# Altium project PCB_Project1.PrjPCB (part 2 of 2)

## Sheet U1 Schematic.SchDoc
size A4
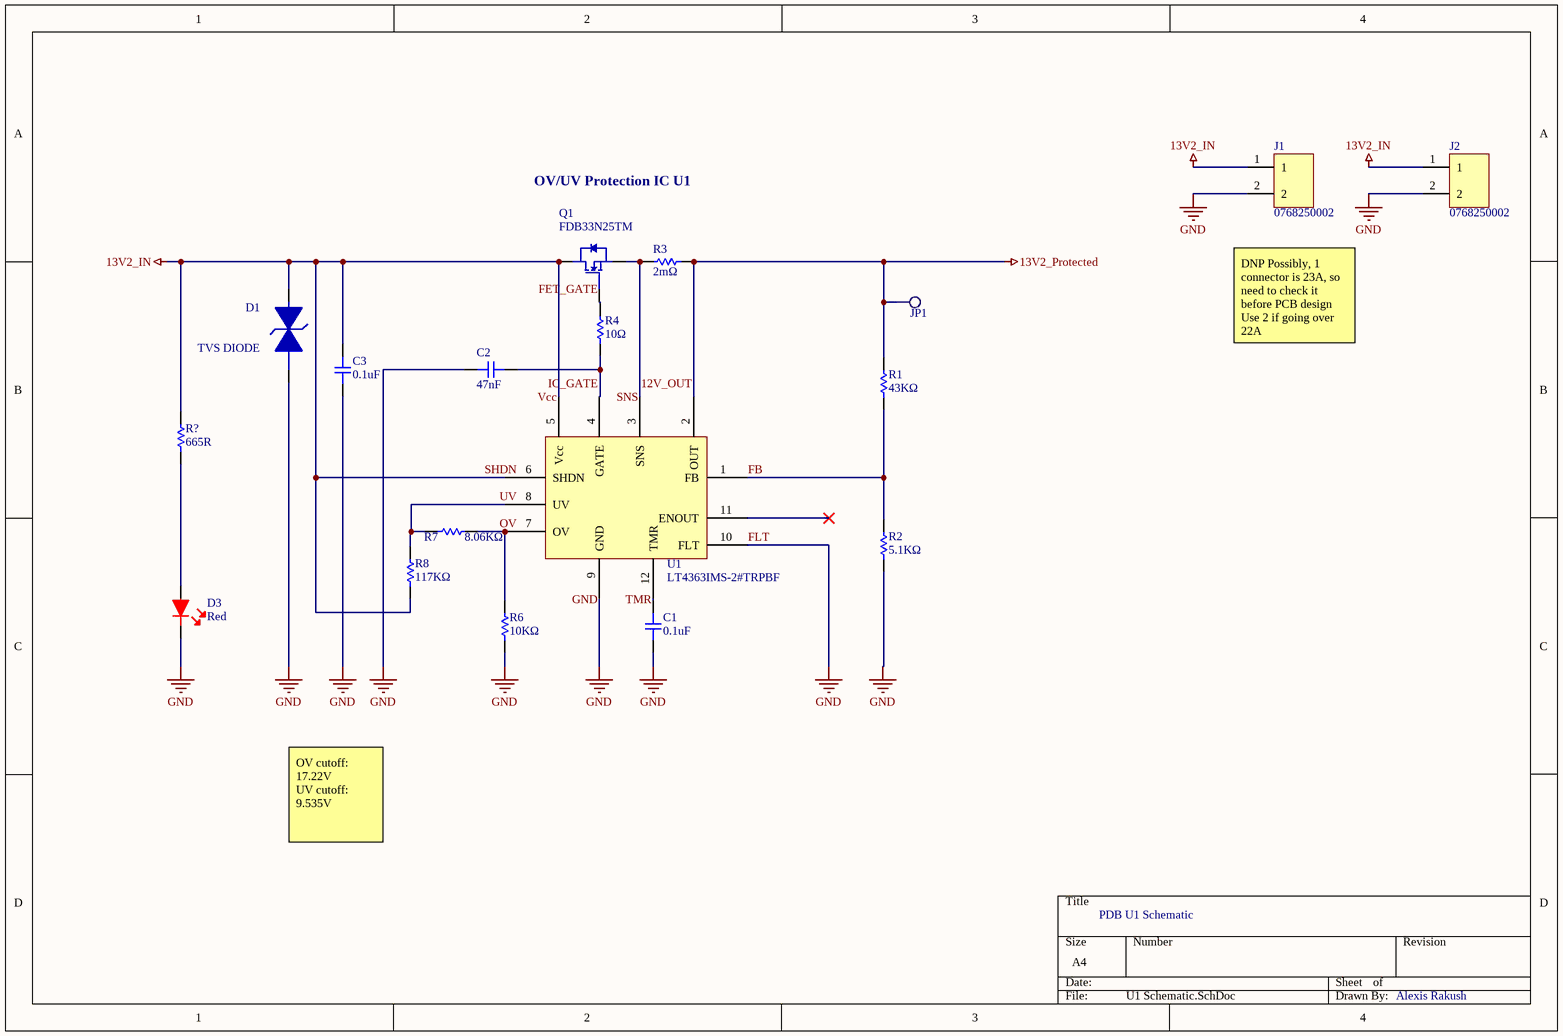
[diagram p1: U1 Schematic.SchDoc]

### Parts
(Parts that share a designator on the sheet are numbered #1, #2 ... from top to bottom, then left to right.)
C1  0.1uF  [CAP-0603]
C2  47nF  [CAP-0603]
C3#2  0.1uF  [CAP-0805]
D1  TVS DIODE  [DIODE_TVS]
D3#2  Red  [LED-0603]
J1  0768250002  [2X1PIN]
J2  0768250002  [2X1PIN]
JP1  Testpoint2  [TP2]  (value not drawn)
Q1  FDB33N25TM
R1  43KΩ
R2  5.1KΩ
R3  2mΩ  [RES-0805]
R4  10Ω  [RES-0805]
R6  10KΩ  [RES-0805]
R7  8.06KΩ  [RES-0603]
R8  117KΩ
R?#3  665R  [RES-0603]
U1  LT4363IMS-2#TRPBF

### Nets
12V_OUT: JP1.1 R1.2 R3.1 U1.2(OUT)  [also labelled 13V2_Protected]
FLT: C1.1 C2.1 C3#2.1 D1.2 D3#2.2 J1.2 J2.2 R2.1 R6.1 U1.9(GND) U1.10(FLT)  [also labelled GND]
Vcc: C3#2.2 D1.1 J1.1 J2.1 Q1.4 R8.1 R?#3.2 U1.5(Vcc) U1.6(SHDN)  [also labelled 13V2_IN]
FB: R1.1 R2.2 U1.1(FB)
SNS: Q1.3 R3.2 U1.3(SNS)
TMR: C1.2 U1.12(TMR)
NetC2_2: C2.2 R4.1 U1.4(GATE)
NetD3#2_1: D3#2.1 R?#3.1
NetQ1_1: Q1.1 R4.2
NetR6_2: R6.2 R7.2 U1.7(OV)
NetR7_1: R7.1 R8.2 U1.8(UV)

Not connected (* = marked no-connect by the designer): U1 11(ENOUT)*

### Notes on the sheet
- OV/UV Protection IC U1
- DNP Possibly, 1 connector is 23A, so need to check it before PCB design
  Use 2 if going over 22A
- OV cutoff: 17.22V
  UV cutoff: 9.535V
- PDB U1 Schematic
- Alexis Rakush
- Labels drawn without touching a wire or pin: FET_GATE, IC_GATE, OV, SHDN, UV

### Library data of the parts
C1 = 0603-0.1uF-16V: CAP CER 0.1UF 16V X7R 0603; Manufacturer: KEMET; Manufacturer Part Number: C0603C104M4RACTU; Dielectric Material: Ceramic; Capacitance: 100nF; Tolerance: 20%; Supplier 1: Digi-Key; Stock 1: 254524; Pricing 1: 1=0.1, 10=0.036, 100=0.0161, 500=0.01152, 1000=0.00904 (USD); Mount: Surface Mount,PCB; Case/Package: 0603; Number of Pins: 2; Case Code (Metric): 1608; Case Code (Imperial): 0603; Min Operating Temperature: -55°C; Max Operating Temperature: 125°C; Package Quantity: 1; Voltage Rating: 16V; Packaging: Tape and Reel; Voltage Rating (DC): 16V; Dielectric: X7R; Termination: SMD/SMT; Length: 1.6mm; Height: 0.8mm; Width: 0.031inch; Thickness: 0.034inch; Lead Pitch: 0.7mm; Depth: 0.8mm; Radiation Hardening: No; REACH SVHC: No SVHC; ComponentLink1URL: https://www.verical.com/server-webapp/html/getDatasheet?partID=66190&src-supplier=Verical; ComponentLink1Description: https://www.verical.com/server-webapp/html/getDatasheet?partID=66190&src-supplier=Verical; ComponentLink2URL: http://www.farnell.com/datasheets/2746055.pdf?src-supplier=Element14; ComponentLink2Description: http://www.farnell.com/datasheets/2746055.pdf?src-supplier=Element14; ComponentLink3URL: http://www.farnell.com/datasheets/2123765.pdf?src-supplier=Element14; ComponentLink3Description: http://www.farnell.com/datasheets/2123765.pdf?src-supplier=Element14; ComponentLink4URL: http://www.alliedelec.com/m/d/9bfe7773041ffe9d406e68bc7b377fdd.pdf?src-supplier=Allied+Electronics; ComponentLink4Description: http://www.alliedelec.com/m/d/9bfe7773041ffe9d406e68bc7b377fdd.pdf?src-supplier=Allied+Electronics; ComponentLink5URL: https://www.verical.com/server-webapp/html/getDatasheet?partID=302288&src-supplier=Verical; ComponentLink5Description: https://www.verical.com/server-webapp/html/getDatasheet?partID=302288&src-supplier=Verical; Supplier Part Number 1: 399-1099-6-ND
C2 = 0603-47nF-50V: CAP CER 0.047UF 50V X7R 0603; Manufacturer: Yageo; Manufacturer Part Number: CC0603KRX7R9BB473; Tolerance: 10%; Supplier 1: Digi-Key; Stock 1: 196940; Pricing 1: 1=0.1, 10=0.058, 100=0.0257, 500=0.01836, 1000=0.01443 (USD); Mount: Surface Mount; Case/Package: 0603; Case Code (Metric): 1608; Case Code (Imperial): 0603; Min Operating Temperature: -55°C; Max Operating Temperature: 125°C; Package Quantity: 1; Capacitance: 47nF; Voltage Rating: 50V; Packaging: Tape and Reel; Voltage Rating (DC): 50V; Dielectric: X7R; Termination: SMD/SMT; Composition: Ceramic; Voltage: 50V; Length: 1.6mm; Height: 0.8mm; Width: 0.031inch; Thickness: 0.035inch; Depth: 0.8mm; Radiation Hardening: No; REACH SVHC: Unknown; Lead Free: Lead Free; Halogen Free: Halogen Free; ComponentLink1URL: http://www.yageo.com/documents/recent/UPY-GPHC_X7R_6.3V-to-50V_18.pdf?src-supplier=Digi-Key; ComponentLink1Description: http://www.yageo.com/documents/recent/UPY-GPHC_X7R_6.3V-to-50V_18.pdf?src-supplier=Digi-Key; ComponentLink2URL: http://www.yageo.com/exep/pages/download/literatures/ProductSelectionGuide%202014_Final_2.pdf?src-supplier=Digi-Key; ComponentLink2Description: http://www.yageo.com/exep/pages/download/literatures/ProductSelectionGuide%202014_Final_2.pdf?src-supplier=Digi-Key; ComponentLink3URL: http://documents.rs-components.com/techlib://itc_doclist_GB.htm?stockno=6698811&src-supplier=RSComponents; ComponentLink3Description: http://documents.rs-components.com/techlib://itc_doclist_GB.htm?stockno=6698811&src-supplier=RSComponents; ComponentLink4URL: http://www.farnell.com/datasheets/1489800.pdf?src-supplier=Element14; ComponentLink4Description: http://www.farnell.com/datasheets/1489800.pdf?src-supplier=Element14; ComponentLink5URL: https://www.verical.com/server-webapp/html/getDatasheet?partID=403593&src-supplier=Verical; ComponentLink5Description: https://www.verical.com/server-webapp/html/getDatasheet?partID=403593&src-supplier=Verical; Supplier Part Number 1: 311-1427-6-ND
C3#2 = 0805-0.1uF-50V: CAP CER 0.1UF 50V Y5V 0805; Manufacturer: KEMET; Manufacturer Part Number: C0805C104Z5VACTU; Dielectric Material: Ceramic; Capacitance: 100nF; Tolerance: 80%; Dissipation Factor: 5%; Supplier 1: Digi-Key; Stock 1: 929243; Pricing 1: 1=0.1, 10=0.057, 100=0.0254, 500=0.01818, 1000=0.01428 (USD); Mount: Surface Mount,PCB; Case/Package: 0805; Number of Pins: 2; Case Code (Metric): 2012; Case Code (Imperial): 0805; Min Operating Temperature: -30°C; Max Operating Temperature: 85°C; Package Quantity: 1; Voltage Rating: 50V; Packaging: Tape and Reel; Voltage Rating (DC): 50V; Dielectric: Y5V; Termination: SMD/SMT; Voltage: 50V; Length: 2mm; Height: 0.9mm; Lead Pitch: 0.75mm; Width: 0.049inch; Thickness: 0.039inch; Depth: 1.25mm; Radiation Hardening: No; REACH SVHC: No SVHC; Lead Free: Lead Free; ComponentLink1URL: http://www.alliedelec.com/m/d/9bfe7773041ffe9d406e68bc7b377fdd.pdf?src-supplier=Allied+Electronics; ComponentLink1Description: http://www.alliedelec.com/m/d/9bfe7773041ffe9d406e68bc7b377fdd.pdf?src-supplier=Allied+Electronics; ComponentLink2URL: https://www.verical.com/server-webapp/html/getDatasheet?partID=37101&src-supplier=Verical; ComponentLink2Description: https://www.verical.com/server-webapp/html/getDatasheet?partID=37101&src-supplier=Verical; ComponentLink3URL: https://www.verical.com/server-webapp/html/getDatasheet?partID=321176&src-supplier=Verical; ComponentLink3Description: https://www.verical.com/server-webapp/html/getDatasheet?partID=321176&src-supplier=Verical; ComponentLink4URL: http://www.farnell.com/datasheets/2123124.pdf?src-supplier=Element14; ComponentLink4Description: http://www.farnell.com/datasheets/2123124.pdf?src-supplier=Element14; Supplier Part Number 1: 399-1177-6-ND
D1 = SMAJ58A-13-F: TVS DIODE 58VWM 93.6VC SMA; Manufacturer: Diodes; Direction: Unidirectional; Reverse Breakdown Voltage: 64.4V; Number of Elements: 1; Max Surge Current: 40A; Reverse Standoff Voltage: 58V; Clamping Voltage: 93.6V; Peak Pulse Power: 400W; Power Line Protection: No; Max Reverse Leakage Current: 5uA; Test Current: 1mA; Peak Pulse Current: 4.3A; Max Breakdown Voltage: 71.2V; Element Configuration: Single; Current: 43A; Forward Voltage: 3.5V; Capacitance: 180pF; Supplier 1: Digi-Key; Manufacturer Part Number: SMAJ58A-13-F; Stock 1: 387453; Pricing 1: 1=0.41, 10=0.311, 100=0.1937, 500=0.13256, 1000=0.10197 (USD); Mount: Surface Mount; Case/Package: SMA; Number of Pins: 2; Contact Plating: Matte,Tin; Min Operating Temperature: -55°C; Max Operating Temperature: 150°C; Package Quantity: 5000; Packaging: Tape and Reel; Number of Unidirectional Channels: 1; Min Breakdown Voltage: 64.4V; Polarity: Unidirectional; Breakdown Voltage: 64.4V; Termination: SMD/SMT; Power Dissipation: 400W; Leakage Current: 5uA; Working Voltage: 58V; Max Power Dissipation: 400W; ESD Protection: No; Voltage: 58V; Max Output Current: 4.3A; Composition: Zener; Length: 2.92mm; Height: 2.3mm; Width: 4.6mm; Radiation Hardening: No; Lead Free: Lead Free; Supplier Part Number 1: SMAJ58A-13-FDIDKR-ND
D3#2 = LED-Red: LED RED CLEAR 0603 SMD; Manufacturer: Wurth Electronics; Manufacturer Part Number: 150060RS75000; Viewing Angle: 140°; Lens Style: Clear,Rectangular; Luminous Intensity: 250mcd; Forward Current: 30mA; Forward Voltage: 2V; Wavelength: 625nm; Test Current: 20mA; Supplier 1: Digi-Key; Stock 1: 18518; Pricing 1: 1=0.14, 50=0.133, 100=0.114, 500=0.099 (USD); Mount: Surface Mount; Case/Package: 0603; Color: Red; Case Code (Metric): 1608; Case Code (Imperial): 0603; Min Operating Temperature: -40°C; Max Operating Temperature: 85°C; Package Quantity: 1; Packaging: Cut Tape; Dominant Wavelength: 625nm; Length: 1.6mm; Height: 0.7mm; Width: 0.8mm; REACH SVHC: Unknown; ComponentLink1URL: https://katalog.we-online.de/led/datasheet/150060RS75000.pdf?src-supplier=Digi-Key; ComponentLink1Description: https://katalog.we-online.de/led/datasheet/150060RS75000.pdf?src-supplier=Digi-Key; ComponentLink2URL: http://www.produktinfo.conrad.com/datenblaetter/750000-774999/759428-da-01-en-CHIPLED_0603_W_KL_ROT_150060RS75000.pdf?src-supplier=Conrad; ComponentLink2Description: http://www.produktinfo.conrad.com/datenblaetter/750000-774999/759428-da-01-en-CHIPLED_0603_W_KL_ROT_150060RS75000.pdf?src-supplier=Conrad; Supplier Part Number 1: 732-4978-6-ND
J1 J2 = 2X1PIN: CONN HEADER R/A 2POS; Manufacturer: Molex; Manufacturer Part Number: 76825-0002; Number of Circuits: 2; Gender: Male; Pitch: 5.7mm; Supplier 1: Digi-Key; Stock 1: 0; Pricing 1: 1=1.13, 10=0.993, 25=0.9344, 50=0.8956, 100=0.8567, 250=0.7788, 500=0.70092, 1000=0.62304, 2500=0.56463 (USD); Color: Black; Contact Plating: Tin; Contact Material: Copper; Termination: Through Hole; Number of Rows: 2; Orientation: Right Angle; Number of Contacts: 2; REACH SVHC: Unknown; ComponentLink1URL: http://www.farnell.com/datasheets/1968956.pdf?src-supplier=Element14; ComponentLink1Description: http://www.farnell.com/datasheets/1968956.pdf?src-supplier=Element14; ComponentLink2URL: http://www.farnell.com/datasheets/2216551.pdf?src-supplier=Newark; ComponentLink2Description: http://www.farnell.com/datasheets/2216551.pdf?src-supplier=Newark; ComponentLink3URL: http://www.farnell.com/datasheets/2216551.pdf?src-supplier=Farnell; ComponentLink3Description: http://www.farnell.com/datasheets/2216551.pdf?src-supplier=Farnell; ComponentLink4URL: https://www.molex.com/pdm_docs/sd/768250002_sd.pdf?src-supplier=Digi-Key; ComponentLink4Description: https://www.molex.com/pdm_docs/sd/768250002_sd.pdf?src-supplier=Digi-Key; ComponentLink5URL: http://www.farnell.com/datasheets/2001779.pdf?src-supplier=Element14; ComponentLink5Description: http://www.farnell.com/datasheets/2001779.pdf?src-supplier=Element14; ComponentLink6URL: http://www.alliedelec.com/images/products/datasheets/bm/BrandonData/70717238.pdf?src-supplier=Allied+Electronics; ComponentLink6Description: http://www.alliedelec.com/images/products/datasheets/bm/BrandonData/70717238.pdf?src-supplier=Allied+Electronics; Supplier Part Number 1: WM11969-ND
JP1 = Testpoint2: Single layer pad TP
Q1 = FDB33N25TM: Trans MOSFET N-CH 250V 33A 3-Pin(2+Tab) D2PAK T/R; Manufacturer: ON Semiconductor / Fairchild; Rise Time: 230ns; Fall Time: 120ns; Turn-Off Delay Time: 75ns; Turn-On Delay Time: 35ns; Gate to Source Voltage (Vgs): 30V; Rds On Max: 94mR; Input Capacitance: 2.135nF; Max Power Dissipation: 235W; Number of Elements: 1; Nominal Vgs: 3V; Element Configuration: Single; Polarity: N-CHANNEL; Supplier 1: Digi-Key; Manufacturer Part Number: FDB33N25TM; Stock 1: 186; Pricing 1: 1=1.88, 10=1.559, 25=1.508, 100=1.2407 (USD); Mount: Surface Mount; Case/Package: D2PAK; Number of Pins: 3; Contact Plating: Tin,Matte; Weight: 1.31247g; Min Operating Temperature: -55°C; Max Operating Temperature: 150°C; Continuous Drain Current (ID): 33A; Packaging: Tape and Reel; Package Quantity: 800; Drain to Source Voltage (Vdss): 250V; Drain to Source Breakdown Voltage: 250V; Power Dissipation: 235W; Drain to Source Resistance: 94mR; Threshold Voltage: 3V; On-State Resistance: 94MR; Series: UniFET™; Drain-source On Resistance-Max: 94MR; Length: 10.67mm; Width: 11.33mm; Height: 4.83mm; Radiation Hardening: No; REACH SVHC: No SVHC; Lead Free: Lead Free; ComponentLink1URL: http://www.farnell.com/datasheets/2304001.pdf?src-supplier=Element14; ComponentLink1Description: http://www.farnell.com/datasheets/2304001.pdf?src-supplier=Element14; ComponentLink2URL: https://www.fairchildsemi.com/datasheets/FD/FDB33N25.pdf?src-supplier=Avnet+Europe; ComponentLink2Description: https://www.fairchildsemi.com/datasheets/FD/FDB33N25.pdf?src-supplier=Avnet+Europe; ComponentLink3URL: https://www.fairchildsemi.com/datasheets/FD/FDB33N25.pdf?src-supplier=Digi-Key; ComponentLink3Description: https://www.fairchildsemi.com/datasheets/FD/FDB33N25.pdf?src-supplier=Digi-Key; ComponentLink4URL: https://www.onsemi.com/pub/Collateral/FDB33N25-D.pdf?src-supplier=Digi-Key; ComponentLink4Description: https://www.onsemi.com/pub/Collateral/FDB33N25-D.pdf?src-supplier=Digi-Key; Supplier Part Number 1: FDB33N25TMDKR-ND
R1 = 0805-43KR: RES SMD 43K OHM 1% 1/8W 0805; Manufacturer: Panasonic; Manufacturer Part Number: ERJ-6ENF4302V; Resistance: 43kR; Power Rating: 125mW; Voltage Rating: 150V; Temperature Coefficient: 100ppm/°C; Supplier 1: Digi-Key; Stock 1: 65734; Pricing 1: 1=0.1, 10=0.072, 100=0.0275, 1000=0.0121, 2500=0.01045 (USD); Mount: Surface Mount; Case/Package: 0805; Case Code (Metric): 2012; Case Code (Imperial): 0805; Contact Plating: Tin; Min Operating Temperature: -55°C; Max Operating Temperature: 155°C; Tolerance: 1%; Packaging: Tape and Reel; Package Quantity: 1; Resistor Type: Thick Film; Number of Terminations: 2; Max Power Dissipation: 125mW; Voltage Rating (DC): 150V; Series: ERJ; Resistance Tolerance: 1%; Construction: Rectangular; Termination: SMD/SMT; Features: Automotive AEC-Q200; Technology: THICK FILM; Length: 2mm; Width: 0.049inch; Height: 0.6mm; Depth: 1.25mm; Radiation Hardening: No; REACH SVHC: Yes; Military Standard: Not; RoHS Compliant: Yes; ComponentLink1URL: http://www.farnell.com/datasheets/1678782.pdf?src-supplier=Element14; ComponentLink1Description: http://www.farnell.com/datasheets/1678782.pdf?src-supplier=Element14; ComponentLink2URL: http://industrial.panasonic.com/www-data/pdf/AOA0000/AOA0000CE2.pdf?src-supplier=Avnet+Europe; ComponentLink2Description: http://industrial.panasonic.com/www-data/pdf/AOA0000/AOA0000CE2.pdf?src-supplier=Avnet+Europe; Supplier Part Number 1: P43.0KCDKR-ND
R2 = 0805-5.1KR: RES SMD 5.1K OHM 1% 1/8W 0805; Manufacturer: TE Connectivity; Manufacturer Part Number: 1623257-1; Resistance: 5.1kR; Power Rating: 125mW; Temperature Coefficient: 100ppm/°C; Supplier 1: Digi-Key; Stock 1: 34405; Pricing 1: 1=0.1, 10=0.049, 100=0.02, 1000=0.00898, 2500=0.00779 (USD); Mount: Surface Mount; Case/Package: 0805; Min Operating Temperature: -55°C; Max Operating Temperature: 125°C; Packaging: Tape and Reel; Tolerance: 1%; Package Quantity: 5000; Resistor Type: Thick Film; Number of Terminations: 2; Series: CRG, Neohm; Max Power Dissipation: 125mW; Construction: Rectangular; Length: 2mm; Width: 0.049inch; Height: 0.026inch; Depth: 1.25mm; Radiation Hardening: No; RoHS Compliant: Yes; Military Standard: Not; ComponentLink1URL: http://www.te.com/commerce/DocumentDelivery/DDEController?Action=showdoc&DocId=Data+Sheet%7F1773204%7FF%7Fpdf%7FEnglish%7FENG_DS_1773204_F.pdf&src-supplier=Avnet+Europe; ComponentLink1Description: http://www.te.com/commerce/DocumentDelivery/DDEController?Action=showdoc&DocId=Data+Sheet%7F1773204%7FF%7Fpdf%7FEnglish%7FENG_DS_1773204_F.pdf&src-supplier=Avnet+Europe; ComponentLink2URL: http://www.te.com/commerce/DocumentDelivery/DDEController?Action=srchrtrv&DocNm=1773204&DocType=DS&DocLang=English&src-supplier=Digi-Key; ComponentLink2Description: http://www.te.com/commerce/DocumentDelivery/DDEController?Action=srchrtrv&DocNm=1773204&DocType=DS&DocLang=English&src-supplier=Digi-Key; ComponentLink3URL: http://www.onlinecomponents.com/productFiles/mf-AMP/eng_ds_1773204_e.pdf?src-supplier=Onlinecomponents.com; ComponentLink3Description: http://www.onlinecomponents.com/productFiles/mf-AMP/eng_ds_1773204_e.pdf?src-supplier=Onlinecomponents.com; Supplier Part Number 1: A126379DKR-ND
R3 = 0805-2mR: RES 0.002 OHM 1% 1/2W 0805; Manufacturer: Vishay Dale; Manufacturer Part Number: CRCW08055K00FKTA; Resistance: 5kR; Power Rating: 125mW; Voltage Rating: 150V; Temperature Coefficient: 100ppm/°C; Supplier 1: Digi-Key; Stock 1: 4986; Pricing 1: 1=0.14, 10=0.129, 100=0.0496, 1000=0.02182, 2500=0.01885 (USD); Case/Package: 0805; Number of Pins: 2; Weight: 0.000194oz; Case Code (Imperial): 0805; Case Code (Metric): 2012; Contact Plating: Tin,Lead; Min Operating Temperature: -55°C; Max Operating Temperature: 155°C; Tolerance: 1%; Packaging: Tape and Reel; Package Quantity: 5000; Composition: Thick Film; Termination: SMD/SMT; Number of Terminations: 2; Max Power Dissipation: 125mW; Voltage Rating (DC): 150V; Features: Automotive AEC-Q200; Length: 0.079inch; Height: 0.02inch; Width: 1.25mm; REACH SVHC: Unknown; Lead Free: Contains Lead; ComponentLink1URL: http://www.vishay.com/docs/20008/dcrcw.pdf?src-supplier=Avnet; ComponentLink1Description: http://www.vishay.com/docs/20008/dcrcw.pdf?src-supplier=Avnet; ComponentLink2URL: http://www.farnell.com/datasheets/2049157.pdf?src-supplier=Element14; ComponentLink2Description: http://www.farnell.com/datasheets/2049157.pdf?src-supplier=Element14; Supplier Part Number 1: 541-4321-6-ND
R4 = 0805-10R: RES SMD 10 OHM 1% 1/8W 0805; Manufacturer: Yageo; Manufacturer Part Number: RC0805FR-0710RL; Resistance: 10R; Power Rating: 125mW; Voltage Rating: 150V; Temperature Coefficient: 200ppm/°C; Supplier 1: Digi-Key; Stock 1: 1677108; Pricing 1: 1=0.1, 10=0.072, 100=0.0277, 1000=0.01219, 2500=0.01053 (USD); Case/Package: 0805; Number of Pins: 2; Case Code (Imperial): 0805; Case Code (Metric): 2012; Min Operating Temperature: -55°C; Max Operating Temperature: 155°C; Tolerance: 1%; Packaging: Tape and Reel; Package Quantity: 1; Termination: SMD/SMT; Composition: Thick Film; Number of Terminations: 2; Max Power Dissipation: 125mW; Features: Moisture Resistant; Voltage Rating (DC): 150V; Length: 2mm; Height: 0.5mm; Width: 1.25mm; Depth: 1.25mm; REACH SVHC: No SVHC; Lead Free: Lead Free; ComponentLink1URL: http://www.farnell.com/datasheets/444164.pdf?src-supplier=Element14; ComponentLink1Description: http://www.farnell.com/datasheets/444164.pdf?src-supplier=Element14; ComponentLink2URL: http://www.farnell.com/datasheets/2167052.pdf?src-supplier=Element14; ComponentLink2Description: http://www.farnell.com/datasheets/2167052.pdf?src-supplier=Element14; ComponentLink3URL: http://www.farnell.com/datasheets/2167052.pdf?src-supplier=Mouser; ComponentLink3Description: http://www.farnell.com/datasheets/2167052.pdf?src-supplier=Mouser; ComponentLink4URL: http://www.yageo.com/documents/recent/PYu-RC_Group_51_RoHS_L_10.pdf?src-supplier=Digi-Key; ComponentLink4Description: http://www.yageo.com/documents/recent/PYu-RC_Group_51_RoHS_L_10.pdf?src-supplier=Digi-Key; Supplier Part Number 1: 311-10.0CRDKR-ND
R6 = 0805-10KR: RES SMD 10K OHM 1% 1/8W 0805; Manufacturer: Yageo; Manufacturer Part Number: RC0805FR-0710KL; Resistance: 10kR; Temperature Coefficient: 100ppm/°C; Power Rating: 125mW; Voltage Rating: 150V; Supplier 1: Digi-Key; Stock 1: 26112993; Pricing 1: 1=0.1, 10=0.04, 100=0.0163, 1000=0.00731, 2500=0.00635 (USD); Case/Package: 0805; Case Code (Imperial): 0805; Case Code (Metric): 2012; Min Operating Temperature: -55°C; Max Operating Temperature: 155°C; Packaging: Tape and Reel; Tolerance: 1%; Composition: Thick Film; Package Quantity: 1; Termination: SMD/SMT; Number of Terminations: 2; Military Standard: Not; Max Power Dissipation: 125mW; Features: Moisture Resistant; Length: 2mm; Height: 0.024inch; Width: 0.049inch; Depth: 1.25mm; REACH SVHC: Unknown; Lead Free: Lead Free; ComponentLink1URL: http://www.yageo.com/documents/recent/PYu-RC_Group_51_RoHS_L_9.pdf?src-supplier=Mouser; ComponentLink1Description: http://www.yageo.com/documents/recent/PYu-RC_Group_51_RoHS_L_9.pdf?src-supplier=Mouser; ComponentLink2URL: http://www.farnell.com/datasheets/2167052.pdf?src-supplier=Element14; ComponentLink2Description: http://www.farnell.com/datasheets/2167052.pdf?src-supplier=Element14; ComponentLink3URL: http://www.yageo.com/documents/recent/PYu-RC_Group_51_RoHS_L_10.pdf?src-supplier=Digi-Key; ComponentLink3Description: http://www.yageo.com/documents/recent/PYu-RC_Group_51_RoHS_L_10.pdf?src-supplier=Digi-Key; ComponentLink4URL: http://www.yageo.ru/pdf/RC0805.pdf?src-supplier=Future+Electronics; ComponentLink4Description: http://www.yageo.ru/pdf/RC0805.pdf?src-supplier=Future+Electronics; Supplier Part Number 1: 311-10.0KCRCT-ND
R7 = 0603-8.06KR: RES SMD 8.06K OHM 1% 1/10W 0603; Manufacturer: Panasonic; Manufacturer Part Number: ERJ-3EKF8061V; Voltage Rating: 75V; Resistance: 8.06kR; Power Rating: 100mW; Temperature Coefficient: 100ppm/°C; Voltage Rating (DC): 50V; Supplier 1: Digi-Key; Stock 1: 296308; Pricing 1: 1=0.1, 10=0.032, 100=0.013, 1000=0.00583, 2500=0.00506 (USD); Mount: Surface Mount; Case/Package: 0603; Case Code (Imperial): 0603; Case Code (Metric): 1608; Contact Plating: Tin; Min Operating Temperature: -55°C; Max Operating Temperature: 155°C; Packaging: Tape and Reel; Tolerance: 1%; Package Quantity: 1; Termination: SMD/SMT; Resistor Type: Thick Film; Number of Terminations: 2; Max Power Dissipation: 100mW; Features: Automotive AEC-Q200; Length: 1.6mm; Width: 0.8mm; Height: 0.022inch; Depth: 0.8mm; Radiation Hardening: No; REACH SVHC: Unknown; Military Standard: Not; Lead Free: Lead Free; ComponentLink1URL: http://industrial.panasonic.com/www-data/pdf/AOA0000/AOA0000CE2.pdf?src-supplier=Avnet; ComponentLink1Description: http://industrial.panasonic.com/www-data/pdf/AOA0000/AOA0000CE2.pdf?src-supplier=Avnet; ComponentLink2URL: https://www.alliedelec.com/m/d/623f45ff1957d936ff56d46fd1c28cac.pdf?src-supplier=Allied+Electronics; ComponentLink2Description: https://www.alliedelec.com/m/d/623f45ff1957d936ff56d46fd1c28cac.pdf?src-supplier=Allied+Electronics; ComponentLink3URL: http://www.farnell.com/datasheets/1678782.pdf?src-supplier=Element14; ComponentLink3Description: http://www.farnell.com/datasheets/1678782.pdf?src-supplier=Element14; ComponentLink4URL: http://www.farnell.com/datasheets/1911175.pdf?src-supplier=Element14; ComponentLink4Description: http://www.farnell.com/datasheets/1911175.pdf?src-supplier=Element14; ComponentLink5URL: http://industrial.panasonic.com/www-data/pdf/AOA0000/AOA0000CE2.pdf?src-supplier=Avnet+Europe; ComponentLink5Description: http://industrial.panasonic.com/www-data/pdf/AOA0000/AOA0000CE2.pdf?src-supplier=Avnet+Europe; ComponentLink6URL: http://www.farnell.com/datasheets/1911175.pdf?src-supplier=Farnell; ComponentLink6Description: http://www.farnell.com/datasheets/1911175.pdf?src-supplier=Farnell; Supplier Part Number 1: P8.06KHDKR-ND
R8 = 0603-117KR: RES 117K OHM 0.5% 1/10W 0603; Manufacturer: Yageo; Manufacturer Part Number: RT0603DRE07117KL; Resistance: 117kR; Max Power Dissipation: 100mW; Temperature Coefficient: 50ppm/°C; Supplier 1: Digi-Key; Stock 1: 5704; Pricing 1: 1=0.1, 10=0.092, 100=0.0352, 1000=0.01549, 2500=0.01338 (USD); Case/Package: 0603; Min Operating Temperature: -55°C; Max Operating Temperature: 155°C; Tolerance: 0.5%; Resistor Type: Thin Film; Packaging: Tape and Reel; Number of Terminations: 2; ComponentLink1URL: http://www.yageo.com/documents/recent/PYu-RT_1-to-0.01_RoHS_L_9.pdf?src-supplier=Digi-Key; ComponentLink1Description: http://www.yageo.com/documents/recent/PYu-RT_1-to-0.01_RoHS_L_9.pdf?src-supplier=Digi-Key; Supplier Part Number 1: 13-RT0603DRE07117KLDKR-ND
R?#3 = 0603-665R: RES SMD 665 OHM 1% 1/10W 0603; Manufacturer: Yageo; Manufacturer Part Number: RC0603FR-07665RL; Power Rating: 100mW; Voltage Rating: 75V; Temperature Coefficient: 100ppm/°C; Voltage Rating (DC): 50V; Supplier 1: Digi-Key; Stock 1: 143871; Pricing 1: 1=0.1, 10=0.023, 100=0.0094, 1000=0.00421, 2500=0.00366 (USD); Case/Package: 0603; Weight: 7.1E-05oz; Case Code (Imperial): 0603; Case Code (Metric): 1608; Contact Plating: Tin,Matte; Min Operating Temperature: -55°C; Max Operating Temperature: 155°C; Resistance: 665R; Tolerance: 1%; Packaging: Tape and Reel; Termination: SMD/SMT; Composition: Thick Film; Military Standard: Not; Package Quantity: 1; Number of Terminations: 2; Max Power Dissipation: 100mW; Features: Moisture Resistant; Length: 1.6mm; Height: 0.022inch; Width: 0.8mm; Depth: 0.8mm; Lead Free: Lead Free; ComponentLink1URL: http://www.yageo.com/documents/recent/PYu-RC_Group_51_RoHS_L_9.pdf?src-supplier=Digi-Key; ComponentLink1Description: http://www.yageo.com/documents/recent/PYu-RC_Group_51_RoHS_L_9.pdf?src-supplier=Digi-Key; ComponentLink2URL: http://www.yageo.com/documents/recent/PYu-RC0603_51_RoHS_L_4.pdf?src-supplier=Avnet; ComponentLink2Description: http://www.yageo.com/documents/recent/PYu-RC0603_51_RoHS_L_4.pdf?src-supplier=Avnet; ComponentLink3URL: http://www.yageo.com/documents/recent/PYu-RC_Group_51_RoHS_L_10.pdf?src-supplier=Digi-Key; ComponentLink3Description: http://www.yageo.com/documents/recent/PYu-RC_Group_51_RoHS_L_10.pdf?src-supplier=Digi-Key; ComponentLink4URL: http://www.yageo.com/documents/recent/PYu-RC0603_51_RoHS_L_4.pdf?src-supplier=Avnet+Europe; ComponentLink4Description: http://www.yageo.com/documents/recent/PYu-RC0603_51_RoHS_L_4.pdf?src-supplier=Avnet+Europe; Supplier Part Number 1: 311-665HRDKR-ND
U1 = LT4363IMS-2#TRPBF: IC SURGE STOPPER HV 12-MSOP; Manufacturer: Analog Devices / Linear Technology; Working Voltage: 80V; Clamping Voltage: 27V; Number of Circuits: 1; Supplier 1: Digi-Key; Manufacturer Part Number: LT4363IMS-2#TRPBF; Stock 1: 0; Pricing 1: 1=6.96, 10=6.29, 25=5.9976, 100=4.9735, 250=4.53468, 500=4.24212, 1000=3.864 (USD); Case/Package: TSSOP; Number of Pins: 12; Package Quantity: 2500; Packaging: Tape and Reel; Lead Free: Lead Free; RoHS Compliant: Yes; ComponentLink1URL: http://www.linear.com/docs/40854?src-supplier=Digi-Key; ComponentLink1Description: http://www.linear.com/docs/40854?src-supplier=Digi-Key; Supplier Part Number 1: LT4363IMS-2#TRPBFDKR-ND

## Nets that join several sheets
12V_OUT: U3_U4 (R9.2 U2.8 U2.10), U1 Schematic (JP1.1 R1.2 R3.1 U1.2)
FLT: U3_U4 (37 pins), U1 Schematic (11 pins)
FB: U3_U4 (C4.1 R13.1 R14.2 U3.4), U1 Schematic (R1.1 R2.2 U1.1)